# Altium schematic sheet Photocoupler12Vinput.SchDoc: STM32F446 CNC
size B; Author: AM; CompanyName: Expatria Technologies; DrawnBy: A.Marles; Engineer: AM; Organization: Expatria Technolgoies; DocumentNumber: 14; SheetNumber: 14; SheetTotal: 14
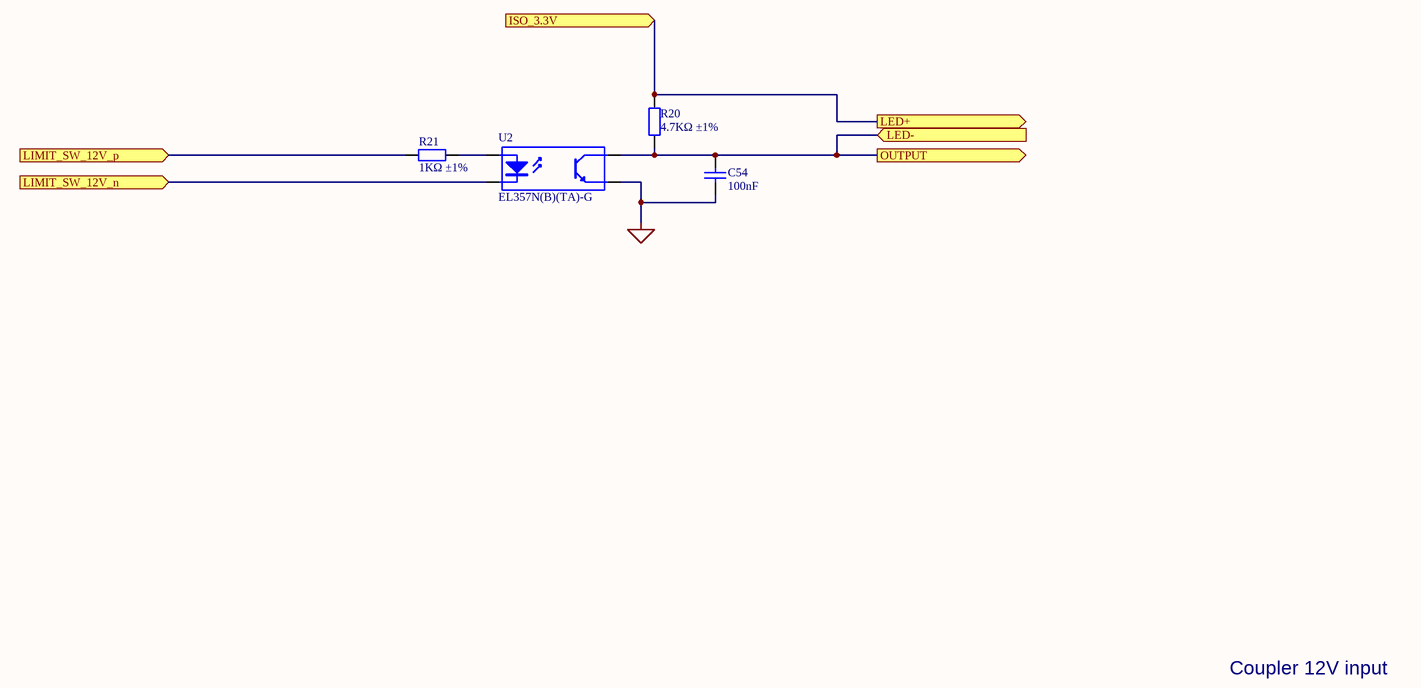
[diagram p0: Photocoupler12Vinput.SchDoc]

## Parts
C54  100nF  [0603_C]
R20  4.7KΩ ±1%  [0603_R]
R21  1KΩ ±1%  [0603_R]
U2  EL357N(B)(TA)-G  [SOP-4_P2.54]

## Ports
ISO_3.3V (in), LED+ (out), LED- (in), LIMIT_SW_12V_n (in), LIMIT_SW_12V_p (in), OUTPUT (out)

## Nets
MCU_GND: C54.1 U2.3(E)
ISO_3.3V: R20.2 ; port LED+, port ISO_3.3V
LED-: C54.2 R20.1 U2.4(C) ; port OUTPUT, port LED-
LIMIT_SW_12V_n: U2.2(K) ; port LIMIT_SW_12V_n
LIMIT_SW_12V_p: R21.1 ; port LIMIT_SW_12V_p
NetR21_2: R21.2 U2.1(A)

## Notes on the sheet
- Coupler 12V input
- SHEET
- Expatria Technologies
- 1136 Glade Court
- Port Coquitlam, BC V3B 1R5
- PROJECT
- SIZE
- ENGR
- MODIFIED
- DOCUMENT
- REV
- Copyright Expatria Technologies 2022. This document describes Open Hardware and is licensed under the CERN-OHL-S v2. No warranty is implied or expressed.
- EMAIL: INFO@EXPATRIA.CA
- B
- /

## Library data of the parts
C54 = 0603 100nF (104) 10% 50V: Chip capacitors; Manufacturer: YAGEO; PartNumber: CC0603KRX7R9BB104; Tolerance: 10%; Voltage: 50V; ComponentLink1Description: Supplier link; ComponentLink1URL: http://www.szlcsc.com/product/details_15331.html; Package: 0603; Supplier: LC; SuppliersPartNumber: C14663; Capacitance: 100nF
R20 = 0603 4.7K (4701) 1%: Chip resistor; Manufacturer: Uniroyal Elec; PartNumber: 0603WAF4701T5E; Power: 1/10W; ComponentLink1Description: Supplier link; ComponentLink1URL: http://www.szlcsc.com/product/details_23889.html; Package: 0603; Supplier: LC; SuppliersPartNumber: C23162; Resistance: 4.7KΩ; Tolerance: 1%
R21 = 0603 1K (1001) 1%: Chip resistor; Manufacturer: Uniroyal Elec; PartNumber: 0603WAF1001T5E; Power: 1/10W; ComponentLink1Description: Supplier link; ComponentLink1URL: http://www.szlcsc.com/product/details_21904.html; Package: 0603; Supplier: LC; SuppliersPartNumber: C21190; Resistance: 1KΩ; Tolerance: 1%
U2 = EL357N(B)(TA)-G_[C6649]: OPTOISOLATOR 3.75KV TRANS 4-SOP; Manufacturer 1: Everlight Elec; ComponentLink1Description: 供应商链接; ComponentLink1URL: http://www.szlcsc.com/product/details_7114.html; Package: SOP-4_P2.54; Supplier: LC; SuppliersPartNumber: C6649; Manufacturer Part Number 1: EL357N(B)(TA)-G